# EAGLE design adb (EAGLE 9.6.1)
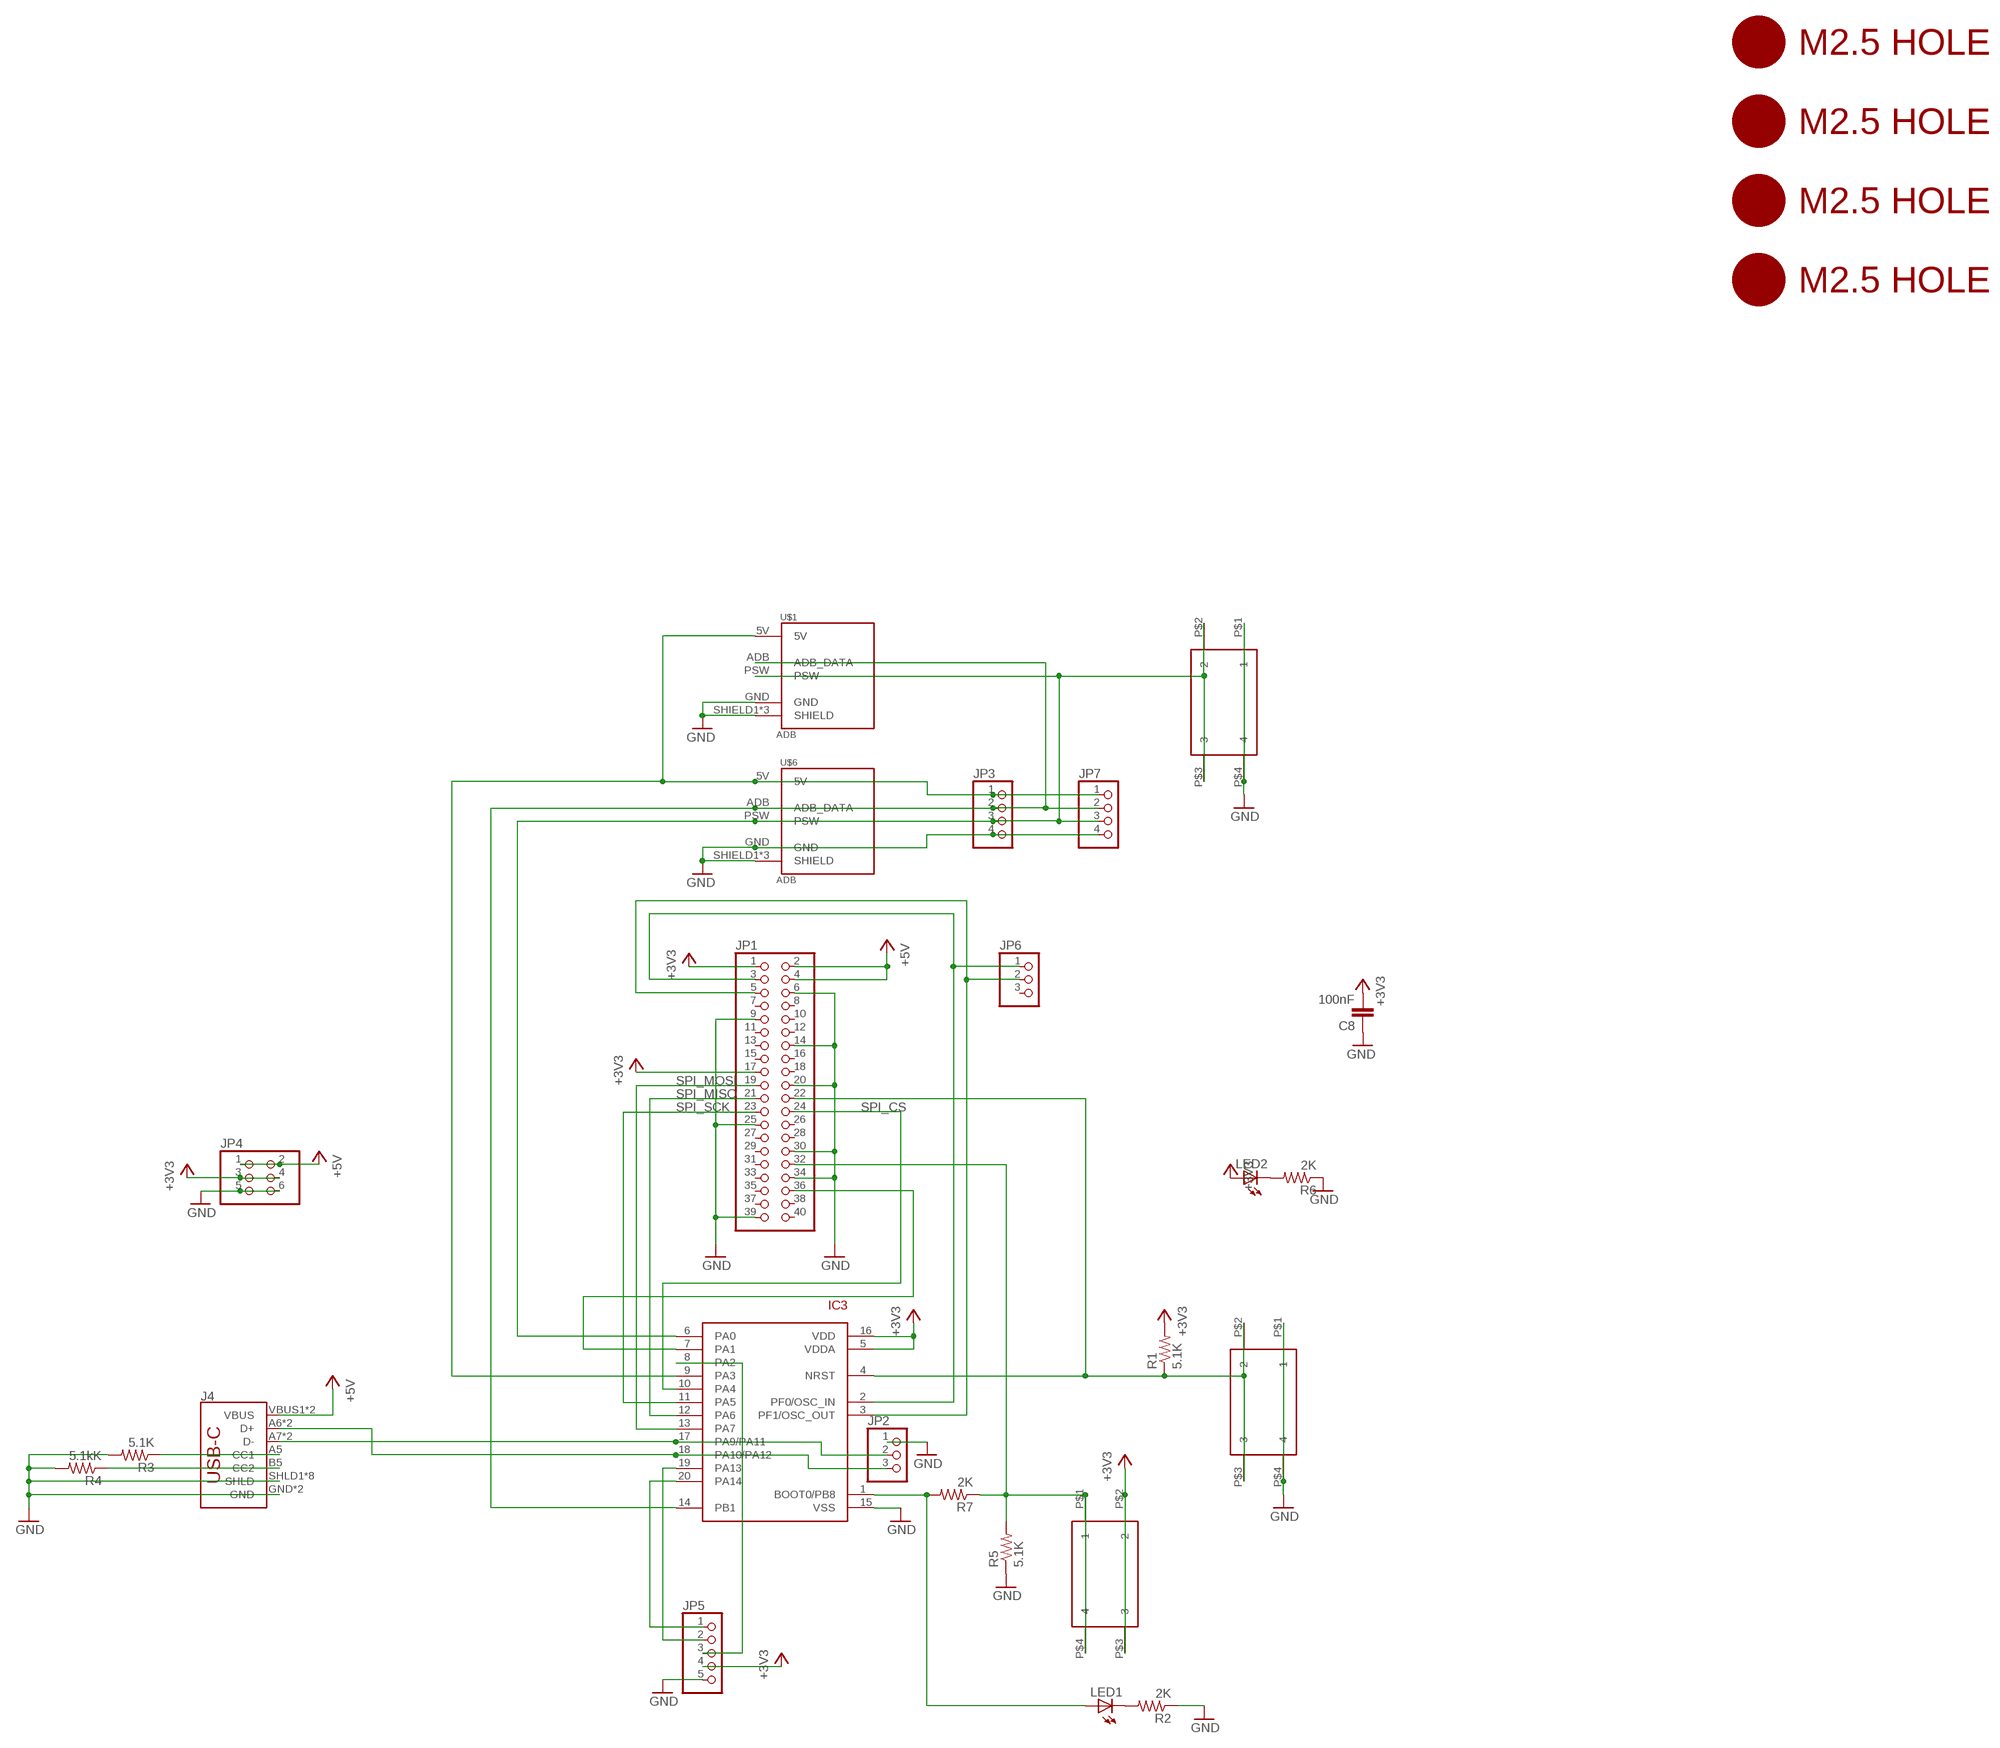
[diagram p0: schematic, sheet 1]

## Parts
C8  100nF  CAP0805  [0805@1]
IC3  STM32F042F4  [TSSOP20]
J4  USB_C16PIN  [USB-C-16P]
JP1  PINHD-2X20-BIG  [2X20-BIG]
JP2  PINHD-1X3  [1X03]
JP3  PINHD-1X4  [1X04]
JP4  PINHD-2X3  [2X03]
JP5  PINHD-1X5  [1X05]
JP6  PINHD-1X3  [1X03]
JP7  PINHD-1X4  [1X04]
LED1  LEDCHIP-LED0805  [CHIP-LED0805]
LED2  LEDCHIP-LED0805  [CHIP-LED0805]
R1  5.1K  RESISTOR0805-RES  [0805]
R2  2K  RESISTOR0805-RES  [0805]
R3  5.1K  RESISTOR0805-RES  [0805]
R4  5.1kK  RESISTOR0805-RES  [0805]
R5  5.1K  RESISTOR0805-RES  [0805]
R6  2K  RESISTOR0805-RES  [0805]
R7  2K  RESISTOR0805-RES  [0805]
SW1  324_SW  [342_SWICH_FOOT]
SW2  324_SW  [342_SWICH_FOOT]
SW4  324_SW  [342_SWICH_FOOT]
U$1  ADB  [DIN4]
U$2  M2.5HOLE  [M2.5HOLE]
U$3  M2.5HOLE  [M2.5HOLE]
U$4  M2.5HOLE  [M2.5HOLE]
U$5  M2.5HOLE  [M2.5HOLE]
U$6  ADB  [DIN4]

## Nets
+3V3: C8.2 IC3.5(VDDA) IC3.16(VDD) JP1.1 JP1.17 JP4.3 JP4.4 JP5.4 LED2.A R1.2 SW1.P$2 SW1.P$3
+5V: J4.VBUS1(VBUS) J4.VBUS2(VBUS) JP1.2 JP1.4 JP4.1 JP4.2
GND: C8.1 IC3.15(VSS) J4.GND J4.GND2(GND) J4.SHLD1(SHLD) J4.SHLD2(SHLD) J4.SHLD3(SHLD) J4.SHLD4(SHLD) J4.SHLD5(SHLD) J4.SHLD6(SHLD) J4.SHLD7(SHLD) J4.SHLD8(SHLD) JP1.6 JP1.9 JP1.14 JP1.20 JP1.25 JP1.30 JP1.34 JP1.39 JP2.1 JP3.4 JP4.5 JP4.6 JP5.5 JP7.4 R2.1 R3.2 R4.2 R5.1 R6.1 SW2.P$1 SW2.P$4 SW4.P$1 SW4.P$4 U$1.GND U$1.SHIELD1(SHIELD) U$1.SHIELD2(SHIELD) U$1.SHIELD3(SHIELD) U$6.GND U$6.SHIELD1(SHIELD) U$6.SHIELD2(SHIELD) U$6.SHIELD3(SHIELD)
N$1: J4.A5(CC1) R3.1
N$2: JP1.32 R5.2 R7.1 SW1.P$1 SW1.P$4
N$3: IC3.18(PA10/PA12) J4.A6(D+) J4.B6(D+) JP2.3
N$4: IC3.17(PA9/PA11) J4.A7(D-) J4.B7(D-) JP2.2
N$5: IC3.8(PA2) JP5.3
N$6: IC3.19(PA13) JP5.2
N$7: J4.B5(CC2) R4.1
N$8: IC3.20(PA14) JP5.1
N$9: IC3.1(BOOT0/PB8) LED1.A R7.2
N$10: IC3.2(PF0/OSC_IN) JP1.3 JP6.1
N$11: IC3.3(PF1/OSC_OUT) JP1.5 JP6.2
N$12: IC3.7(PA1) JP1.36
N$13: IC3.4(NRST) JP1.22 R1.1 SW4.P$2 SW4.P$3
N$14: IC3.9(PA3) JP3.1 JP7.1 U$1.5V U$6.5V
N$15: IC3.14(PB1) JP3.2 JP7.2 U$1.ADB(ADB_DATA) U$6.ADB(ADB_DATA)
N$17: LED1.C R2.2
N$18: IC3.6(PA0) JP3.3 JP7.3 SW2.P$2 SW2.P$3 U$1.PSW U$6.PSW
N$29: LED2.C R6.2
SPI_CS: IC3.10(PA4) JP1.24
SPI_MISO: IC3.12(PA6) JP1.21
SPI_MOSI: IC3.13(PA7) JP1.19
SPI_SCK: IC3.11(PA5) JP1.23
Unconnected: JP1.7 JP1.8 JP1.10 JP1.11 JP1.12 JP1.13 JP1.15 JP1.16 JP1.18 JP1.26 JP1.27 JP1.28 JP1.29 JP1.31 JP1.33 JP1.35 JP1.37 JP1.38 JP1.40 JP6.3

## Library data of the parts
C8 = clock:CAP: Capacitor Standard 0603 ceramic capacitor, and 0.1" leaded capacitor.
IC3 = tx:STM32F042F4
J4 = SparkFun-Connectors:USB_C: USB Type C 16Pin Connector Super Speed pins not available on the 16-pin purely SMD connector so this part is best for USB 2.0 implementations. D1 and D2 are tied together enabling D+/- no matter which way the cable is plugged into the connector. The two channel configuration pins (CC1/2) are exposed. These are normally connected to ground via 5.1k resistors but can be reconfigured for high current/high power applications.; PROD_ID: CONN-14122
JP1 = adafruit_changed:PINHD-2X20: PIN HEADER
JP2 JP6 = pinhead:PINHD-1X3: PIN HEADER
JP3 JP7 = pinhead:PINHD-1X4: PIN HEADER
JP4 = pinhead:PINHD-2X3: PIN HEADER
JP5 = pinhead:PINHD-1X5: PIN HEADER
LED1 LED2 = adafruit:LED: LED OSRAM: - CHIPLED LG R971, LG N971, LY N971, LG Q971, LY Q971, LO R971, LY R971 LH N974, LH R974 LS Q976, LO Q976, LY Q976 LO Q996 - Hyper CHIPLED LW Q18S LB Q993, LB Q99A, LB R99A - SideLED LS A670, LO A670, LY A670, LG A670, LP A670 LB A673, LV A673, LT A673, LW A673 LH A674 LY A675 LS A676, LA A676, LO A676, LY A676, LW A676 LS A679, LY A679, LG A679 - Hyper Micro SIDELED® LS Y876, LA Y876, LO Y876, LY Y876 LT Y87S - SmartLED LW L88C, LW L88S LB L89C, LB L89S, LG L890 LS L89K, LO L89K, LY L89K LS L896, LA L896, LO L896, LY L896 - TOPLED LS T670, LO T670, LY T670, LG T670, LP T670 LSG T670, LSP T670, LSY T670, LOP T670, LYG T670 LG T671, LOG T671, LSG T671 LB T673, LV T673, LT T673, LW T673 LH T674 LS T676, LA T676, LO T676, LY T676, LB T676, LH T676, LSB T676, LW T676 LB T67C, LV T67C, LT T67C, LS T67K, LO T67K, LY T67K, LW E67C LS E67B, LA E67B, LO E67B, LY E67B, LB E67C, LV E67C, LT E67C LW T67C LS T679, LY T679, LG T679 LS T770, LO T770, LY T770, LG T770, LP T770 LB T773, LV T773, LT T773, LW T773 LH T774 LS E675, LA E675, LY E675, LS T675 LS T776, LA T776, LO T776, LY T776, LB T776 LHGB T686 LT T68C, LB T68C - Hyper Mini TOPLED® LB M676 - Mini TOPLED Santana® LG M470 LS M47K, LO M47K, LY M47K Source: http://www.osram.convergy.de/
R1-R7 = SparkFun-Passives:RESISTOR: Resistor Basic schematic elements and footprints for 0603, 1206, and PTH resistors.
SW1 SW2 SW4 = 3pos_slide_switch_centered:324_SW
U$1 U$6 = adb:ADB
U$2-U$5 = f1c100s:M2.5HOLE

## Net classes
1 power: width 0.178 mm

## Board
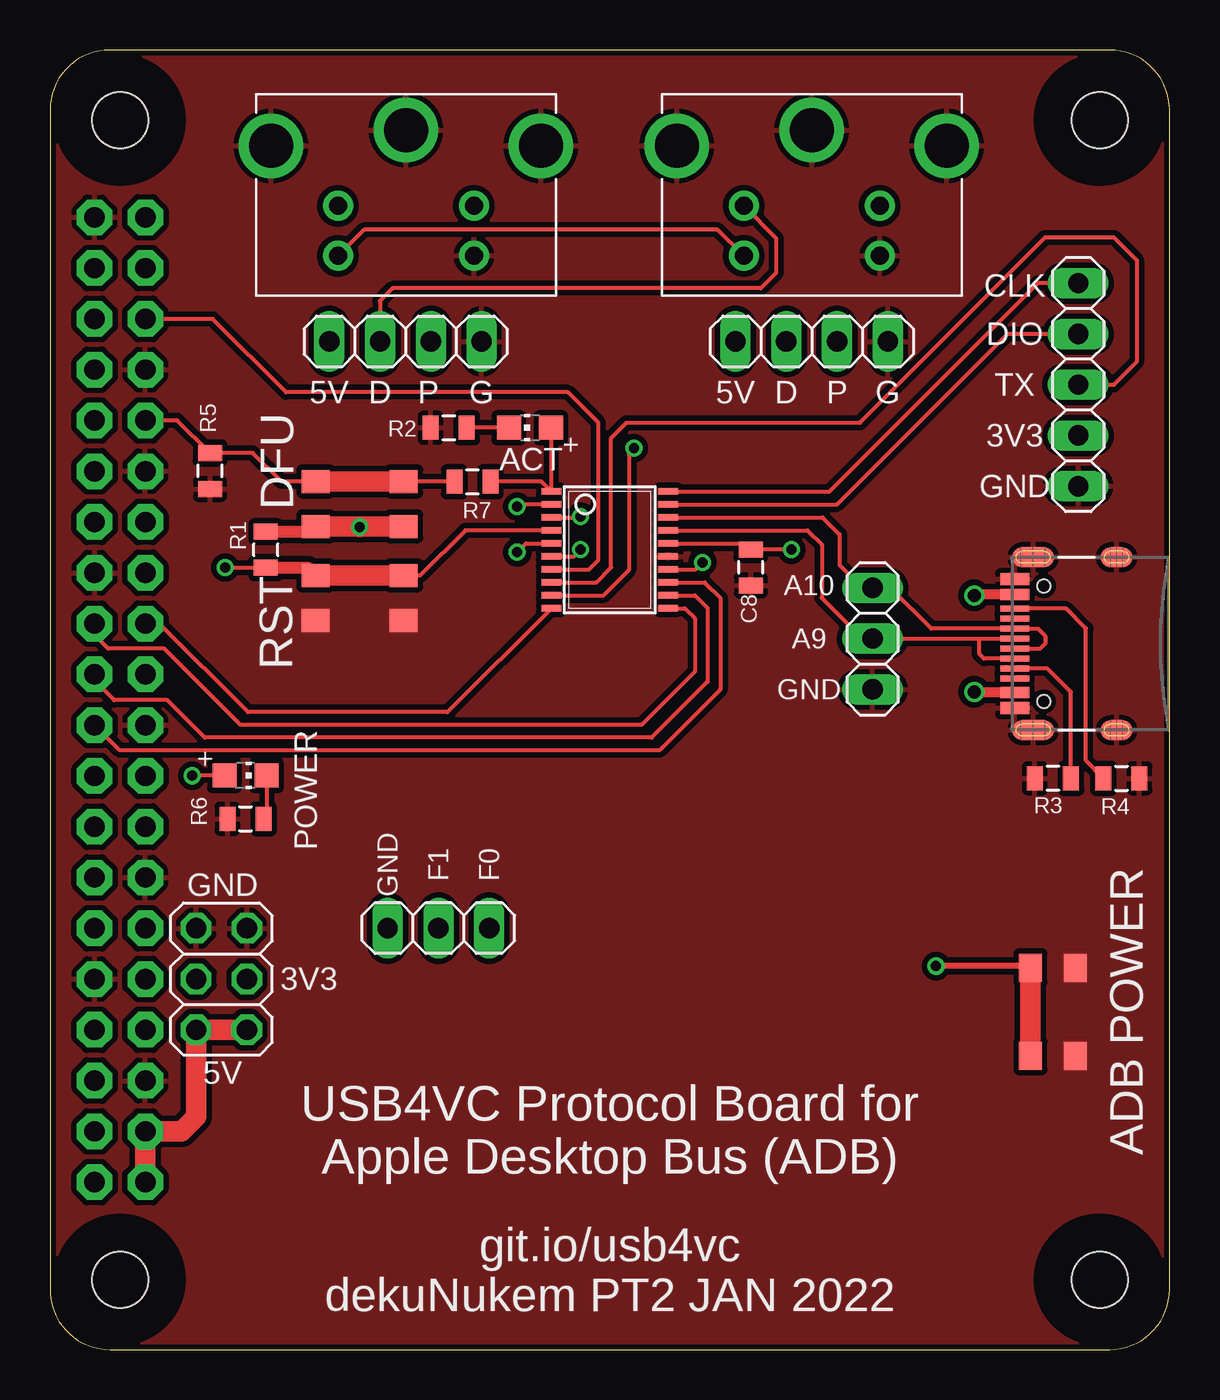
[diagram p1: board, top side]
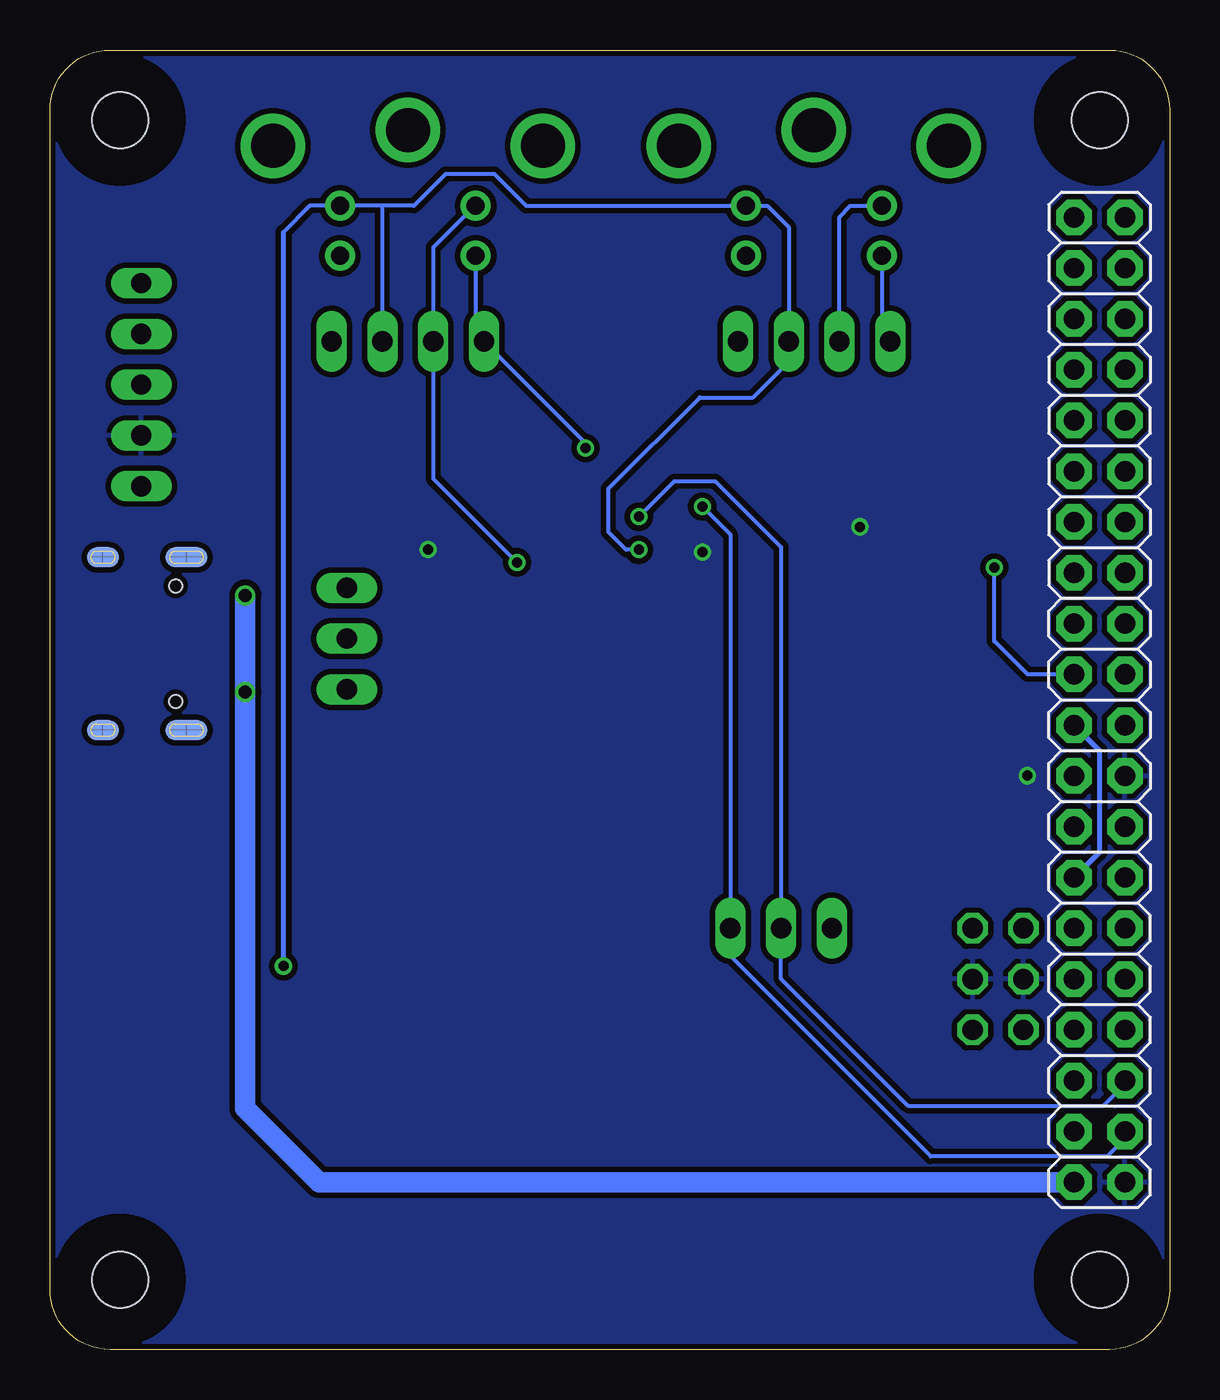
[diagram p2: board, bottom side, seen from below]

Size 56 x 65 mm. Coordinates in mm from the lower left corner, seen from the top.
Outline: 3,0 53,0 arc90 56,3 56,62 arc90 53,65 3,65 arc90 0,62 0,3 arc90 3,0
Copper layers (1*16): Top 0.035mm / dielectric 1.5mm / Bottom 0.035mm
Design rules "deku_2layer_6mil": minimum track width 6mil, minimum drill 15mil, track to track 6mil, track to pad 6mil, pad to pad 6mil, via to via 6mil, smd to smd 6mil, copper to edge 10mil, drill to drill 6mil, minimum pad ring 7mil, minimum via ring 7mil, stop-mask expansion 4mil, vias tented up to drill 25mil, thermal gap 10mil

### Footprints (pad centres in the part's own frame; a part is rotated, then mirrored left to right if it is on the bottom)
0805@1 = smd 0.8 x 1.2: 1 -0.9,0; 2 0.9,0
TSSOP20 = smd 0.305 x 0.991: 1 -2.925,-2.918; 2 -2.275,-2.918; 3 -1.625,-2.918; 4 -0.975,-2.918; 5 -0.325,-2.918; 6 0.325,-2.918; 7 0.975,-2.918; 8 1.625,-2.918; 9 2.275,-2.918; 10 2.925,-2.918; 11 2.925,2.918; 12 2.275,2.918; 13 1.625,2.918; 14 0.975,2.918; 15 0.325,2.918; 16 -0.325,2.918; 17 -0.975,2.918; 18 -1.625,2.918; 19 -2.275,2.918; 20 -2.925,2.918
USB-C-16P = smd 0.3 x 1.45: A5 -1.25,0; A6 -0.25,0; A7 0.25,0; A8 1.25,0; B5 1.75,0; B6 0.75,0; B7 -0.75,0; B8 -1.75,0 | smd 0.6 x 1.45: GND -3.225,0; GND2 3.225,0 | smd 1 x 2.1: SHLD1 -4.32,-0.915; SHLD2 4.32,-0.915 | smd 1 x 2.1 bottom: SHLD3 -4.32,-0.915; SHLD4 4.32,-0.915 | smd 1 x 1.6: SHLD5 -4.32,-5.095; SHLD8 4.32,-5.095 | smd 1 x 1.6 bottom: SHLD6 -4.32,-5.095; SHLD7 4.32,-5.095 | smd 0.55 x 1.45: VBUS1 -2.45,0; VBUS2 2.45,0 | hole 0.65: -2.89,-1.445; 2.89,-1.445
2X20-BIG = drill 1.016 pad 1.778 octagon: 1 -24.13,-1.27; 2 -24.13,1.27; 3 -21.59,-1.27; 4 -21.59,1.27; 5 -19.05,-1.27; 6 -19.05,1.27; 7 -16.51,-1.27; 8 -16.51,1.27; 9 -13.97,-1.27; 10 -13.97,1.27; 11 -11.43,-1.27; 12 -11.43,1.27; 13 -8.89,-1.27; 14 -8.89,1.27; 15 -6.35,-1.27; 16 -6.35,1.27; 17 -3.81,-1.27; 18 -3.81,1.27; 19 -1.27,-1.27; 20 -1.27,1.27; 21 1.27,-1.27; 22 1.27,1.27; 23 3.81,-1.27; 24 3.81,1.27; 25 6.35,-1.27; 26 6.35,1.27; 27 8.89,-1.27; 28 8.89,1.27; 29 11.43,-1.27; 30 11.43,1.27; 31 13.97,-1.27; 32 13.97,1.27; 33 16.51,-1.27; 34 16.51,1.27; 35 19.05,-1.27; 36 19.05,1.27; 37 21.59,-1.27; 38 21.59,1.27; 39 24.13,-1.27; 40 24.13,1.27
1X03 = drill 1.016 long: 1 -2.54,0; 2 0,0; 3 2.54,0
1X04 = drill 1.016 long: 1 -3.81,0; 2 -1.27,0; 3 1.27,0; 4 3.81,0
2X03 = drill 1.016 octagon: 1 -2.54,-1.27; 2 -2.54,1.27; 3 0,-1.27; 4 0,1.27; 5 2.54,-1.27; 6 2.54,1.27
1X05 = drill 1.016 long: 1 -5.08,0; 2 -2.54,0; 3 0,0; 4 2.54,0; 5 5.08,0
CHIP-LED0805 = smd 1.2 x 1.2: A 0,-1.05; C 0,1.05
0805 = smd 0.8 x 1.2: 1 -0.9,0; 2 0.9,0
342_SWICH_FOOT = smd 1.4 x 1.15: P$1 -2.2,-1.125; P$2 -2.2,1.125; P$3 2.2,1.125; P$4 2.2,-1.125
DIN4 = drill 0.9 pad 1.5: 5V -3.4,-6.3; ADB -3.4,-3.8; GND 3.4,-6.3; PSW 3.4,-3.8 | drill 2.2: SHIELD1 -6.75,-0.8; SHIELD2 0,0; SHIELD3 6.75,-0.8
M2.5HOLE = hole 2.8: 0,0

### Placement (x,y rotation side)
C8  35.05,39.12 90 top
IC3  28,40 270 top
J4  48.26,35.31 90 top
JP1  3.5,32.5 90 bottom
JP2  41.15,35.56 90 top
JP3  17.78,50.42 0 top
JP4  8.58,18.53 90 top
JP5  51.44,48.26 270 top
JP6  19.43,21.08 180 top
JP7  38.1,50.42 0 top
LED1  24,46.1 90 top
LED2  9.78,28.7 270 top
R1  10.79,40.01 90 top
R2  19.94,46.1 0 top
R3  50.16,28.57 180 top
R4  53.59,28.57 0 top
R5  8,43.94 90 top
R6  9.78,26.54 0 top
R7  21.13,43.41 0 top
SW1  15.49,42.29 180 top
SW2  50.16,16.89 90 top
SW4  15.49,37.59 0 top
U$1  17.8,61 0 top
U$2  3.5,3.5 0 top
U$3  52.5,3.5 0 top
U$4  3.5,61.5 0 top
U$5  52.5,61.5 0 top
U$6  38.1,61 0 top

### Tracks (layer width: path | path; a pad name or v marks a point on that pad's centre or on a via)
+3V3  (via drill 0.5)
  Top 0.203: v23.37,39.88 23.82,40.33 IC3.5 | v37.08,40.01 35.06,40.01 C8.2 34.74,40.33 IC3.16 | LED2.A v7.11,28.7
  Top 0.61: R1.2 13.03,40.91 SW1.P$3
  Top 1.016: SW1.P$3 15.48,41.17 | 15.48,41.17 v15.49,41.15 | SW1.P$2 15.48,41.17
  pour Bottom (isolate 0.279, rank 2): 0,3 0,62 arc-90 3,65 53,65 arc-90 56,62 56,3 arc-90 53,0 3,0 arc-90
+5V  (via drill 0.65)
  Top 0.508: J4.VBUS2 46.27,37.76 v46.23,37.72 | J4.VBUS1 46.27,32.86 v46.23,32.89
  Top 1.016: JP1.2 JP1.4 6.59,10.91 7.31,11.63 JP4.2 JP4.1
  Bottom 1.016: v46.23,37.72 v46.23,32.89 46.23,12.06 42.53,8.37 JP1.2
GND
  Bottom 0.254: JP1.20 3.5,29.96 3.5,24.88 JP1.14
  pour Top (isolate 0.279): 3,0 53,0 arc90 56,3 56,62 arc90 53,65 3,65 arc90 0,62 0,3 arc90
N$1
  Top 0.203: R3.1 51.06,32.88 49.89,34.06 J4.A5
N$2
  Top 0.203: SW1.P$4 11.57,43.42 10.15,44.84 R5.2 6.37,46.47 JP1.32 | R7.1 17.7,43.41 SW1.P$1
  Top 1.016: SW1.P$4 SW1.P$1
N$3
  Top 0.203: J4.A6 49.53,35.06 49.53,35.05 49.78,35.31 49.78,35.69 49.41,36.06 J4.B6 44.08,36.06 42.04,38.1 JP2.3 40.64,38.1 39.5,39.24 39.5,40.77 38.64,41.62 IC3.18
N$4
  Top 0.203: IC3.17 37.89,40.98 38.61,40.26 38.61,37.59 40.64,35.56 JP2.2 46.48,35.56 | 46.48,35.56 J4.A7 | J4.B7 46.72,34.56 46.48,34.8 46.48,35.56
N$5
  Top 0.203: IC3.8 27.33,38.38 28.07,39.12 28.07,45.59 28.83,46.35 40.51,46.35 49.78,55.63 53.21,55.63 54.36,54.48 54.36,49.4 53.21,48.26 JP5.3
N$6
  Top 0.203: IC3.19 39.35,42.27 47.88,50.8 JP5.2
N$7
  Top 0.203: R4.1 51.82,29.45 51.82,36.07 50.83,37.06 J4.B5
N$8
  Top 0.203: IC3.20 38.99,42.92 49.4,53.34 JP5.1
N$9
  Top 0.203: LED1.A 25.05,42.95 IC3.1 24.6,43.41 R7.2
N$10  (via drill 0.5)
  Top 0.203: IC3.2 23.48,42.27 v23.37,42.16
  Bottom 0.203: JP1.3 2.23,10.53 3.11,9.65 11.94,9.65 21.97,19.68 JP6.1 21.97,40.77 v23.37,42.16
N$11  (via drill 0.5)
  Top 0.203: IC3.3 26.51,41.62 v26.54,41.66
  Bottom 0.203: v26.54,41.66 24.77,43.43 22.73,43.43 19.43,40.13 JP6.2 19.43,20.83 19.43,18.54 13.08,12.19 3.3,12.19 2.23,13.26 JP1.5
N$12
  Top 0.203: IC3.7 26.96,39.02 27.43,39.5 27.43,46.35 25.91,47.88 11.81,47.88 8.14,51.55 JP1.36
N$13  (via drill 0.5)
  Top 0.203: IC3.4 20.78,40.98 18.52,38.72 17.91,38.72 SW4.P$3 | v8.76,39.12 R1.1
  Top 0.61: R1.1 12.91,39.1 SW4.P$2
  Top 1.016: SW4.P$2 17.91,38.72
  Bottom 0.203: JP1.22 7.1,33.77 8.76,35.43 v8.76,39.12
N$14  (via drill 0.5)
  Top 0.203: IC3.9 27.69,37.73 28.96,38.99 28.96,44.83 v29.21,45.09 | U$6.5V 33.39,56.01 15.71,56.01 U$1.5V
  Bottom 0.203: U$1.5V 14.4,50.85 JP3.1 | U$6.5V 34.7,50.83 JP7.1 29.21,45.34 v29.21,45.09
N$15  (via drill 0.5)
  Top 0.203: IC3.14 32.29,39.02 v32.64,39.37 | U$6.ADB 36.32,55.58 36.32,53.85 35.56,53.09 17.14,53.09 16.51,52.45 JP3.2
  Bottom 0.203: JP3.2 16.51,56.64 15.95,57.2 U$1.ADB | U$6.ADB 34.75,57.2 36.83,55.12 JP7.2 36.83,43.56 v32.64,39.37
N$17
  Top 0.203: LED1.C R2.2
N$18  (via drill 0.5)
  Top 0.203: IC3.6 26.21,39.67 v26.54,40.01
  Top 0.305: SW2.P$3 48.95,19.18 v44.32,19.18
  Top 1.016: SW2.P$3 SW2.P$2
  Bottom 0.203: v26.54,40.01 27.18,40.01 28.07,40.89 28.07,43.05 23.5,47.62 20.83,47.62 19.05,49.4 JP3.3 19.05,56.13 20.12,57.2 U$1.PSW 32.18,57.2 33.78,58.8 36.2,58.8 37.8,57.2 39.37,57.2 | 44.32,55.88 43,57.2 U$6.PSW 39.37,57.2 | JP7.3 39.37,57.2
  Bottom 0.254: v44.32,19.18 44.32,55.88
N$29
  Top 0.203: LED2.C 10.83,26.69 R6.2
SPI_CS
  Top 0.203: IC3.10 19.88,31.88 9.91,31.88 5.47,36.31 JP1.24
SPI_MISO
  Top 0.203: IC3.12 32.25,37.73 32.89,37.08 32.89,33.4 30.1,30.61 7.75,30.61 5.87,32.49 3.2,32.49 2.23,33.46 JP1.21
SPI_MOSI
  Top 0.203: IC3.13 32.74,38.38 33.53,37.59 33.53,33.02 30.48,29.97 3.49,29.97 JP1.19
SPI_SCK
  Top 0.203: IC3.11 31.76,37.08 32.26,36.58 32.26,33.91 29.59,31.24 9.53,31.24 5.71,35.05 2.92,35.05 2.23,35.74 JP1.23

### Text on the board
tNames: CLK | DIO | 5V | D | P | G | 5V | D | P | G | TX | 3V3 | ACT | DFU | GND | A10 | RST | A9 | GND | POWER | GND | F1 | F0 | GND | 3V3 | ADB POWER | 5V | USB4VC Protocol Board for / Apple Desktop Bus (ADB) | git.io/usb4vc / dekuNukem PT2 JAN 2022